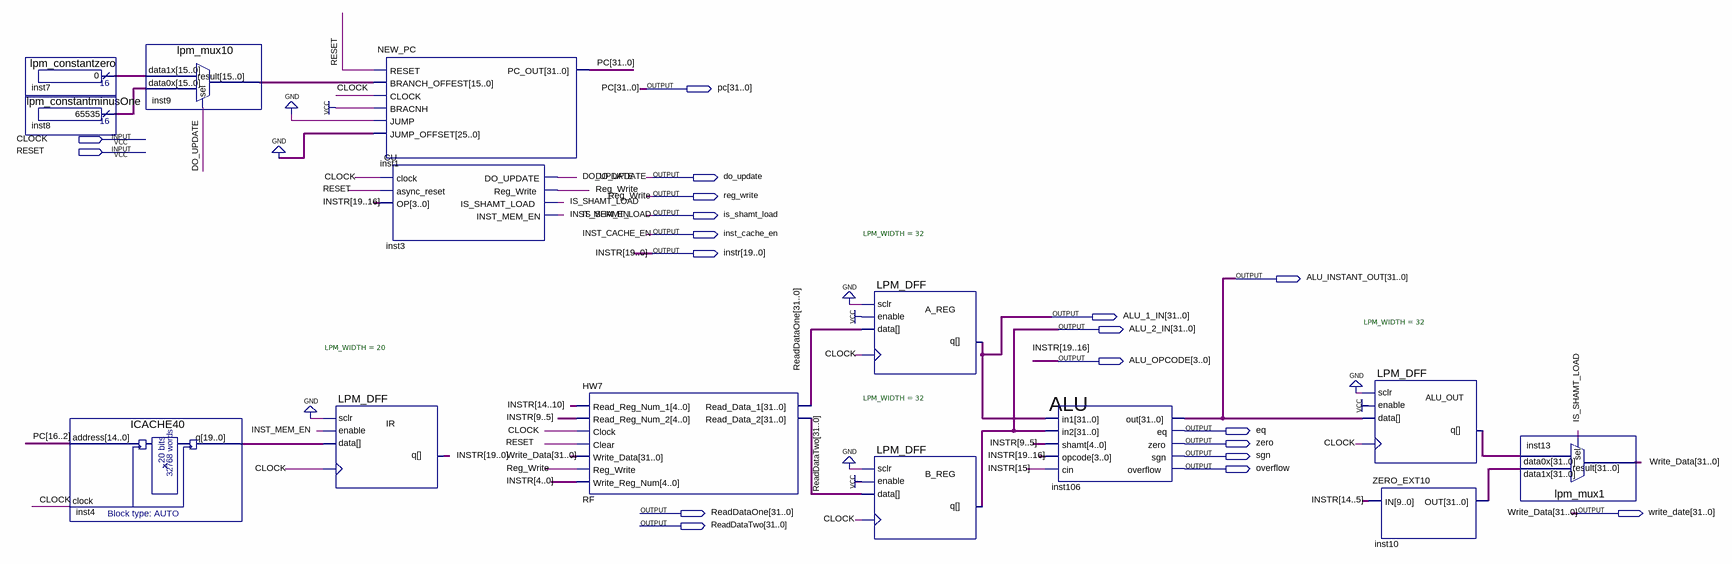
[diagram p0: schematic sheet]
// Quartus schematic CPU.bdf as structural Verilog: 14 symbols, 19 pins
module CPU (
  input  CLOCK,
  input  RESET,
  output [31:0] pc,
  output do_update,
  output reg_write,
  output is_shamt_load,
  output inst_cache_en,
  output [19:0] instr,
  output [31:0] ALU_INSTANT_OUT,
  output [31:0] ALU_1_IN,
  output [31:0] ALU_2_IN,
  output [3:0] ALU_OPCODE,
  output eq,
  output zero,
  output sgn,
  output overflow,
  output [31:0] ReadDataOne,
  output [31:0] write_date,
  output [31:0] ReadDataTwo
);

  wire INST_MEM_EN;
  wire [15:0] inst7_result, inst8_result, inst9_result;
  wire [19:0] inst4_q;
  wire [31:0] ALU_OUT_q, inst10_out;

  lpm_constantzero inst7 (.result(inst7_result));
  lpm_constantminusOne inst8 (.result(inst8_result));
  ICACHE40 inst4 (.address(pc[16:2]), .clock(CLOCK), .q(inst4_q));
  lpm_mux10 inst9 (.data1x(inst7_result), .data0x(inst8_result), .sel(do_update), .result(inst9_result));
  LPM_DFF #(.LPM_WIDTH(20)) IR (
    .enable(INST_MEM_EN), .clock(CLOCK), .data(inst4_q), .sclr(1'b0), .q({ALU_OPCODE, instr[15:0]}));
  NEW_PC inst1 (
    .RESET(RESET), .BRANCH_OFFEST(inst9_result), .CLOCK(CLOCK), .BRACNH(1'b1), .JUMP(1'b0),
    .JUMP_OFFSET({26{1'b0}}), .PC_OUT(pc));
  CU inst3 (
    .clock(CLOCK), .async_reset(RESET), .OP(ALU_OPCODE), .DO_UPDATE(do_update), .Reg_Write(reg_write),
    .IS_SHAMT_LOAD(is_shamt_load), .INST_MEM_EN(INST_MEM_EN));
  HW7 RF (
    .Read_Reg_Num_1(instr[14:10]), .Read_Reg_Num_2(instr[9:5]), .Clock(CLOCK), .Clear(RESET),
    .Write_Data(write_date), .Reg_Write(reg_write), .Write_Reg_Num(instr[4:0]), .Read_Data_1(ReadDataOne),
    .Read_Data_2(ReadDataTwo));
  LPM_DFF #(.LPM_WIDTH(32)) A_REG (.enable(1'b1), .clock(CLOCK), .data(ReadDataOne), .sclr(1'b0), .q(ALU_1_IN));
  LPM_DFF #(.LPM_WIDTH(32)) B_REG (.enable(1'b1), .clock(CLOCK), .data(ReadDataTwo), .sclr(1'b0), .q(ALU_2_IN));
  ALU inst106 (
    .in1(ALU_1_IN), .in2(ALU_2_IN), .shamt(instr[9:5]), .opcode(ALU_OPCODE), .cin(instr[15]),
    .out(ALU_INSTANT_OUT), .eq(eq), .zero(zero), .sgn(sgn), .overflow(overflow));
  LPM_DFF #(.LPM_WIDTH(32)) ALU_OUT (.enable(1'b1), .clock(CLOCK), .data(ALU_INSTANT_OUT), .sclr(1'b0), .q(ALU_OUT_q));
  ZERO_EXT10 inst10 (.IN(instr[14:5]), .OUT(inst10_out));
  lpm_mux1 inst13 (.data1x(inst10_out), .data0x(ALU_OUT_q), .sel(is_shamt_load), .result(write_date));

  assign instr[19:16] = ALU_OPCODE;

  // Other names for the same wires on the sheet: Write_Data[31:0] = write_date
endmodule
